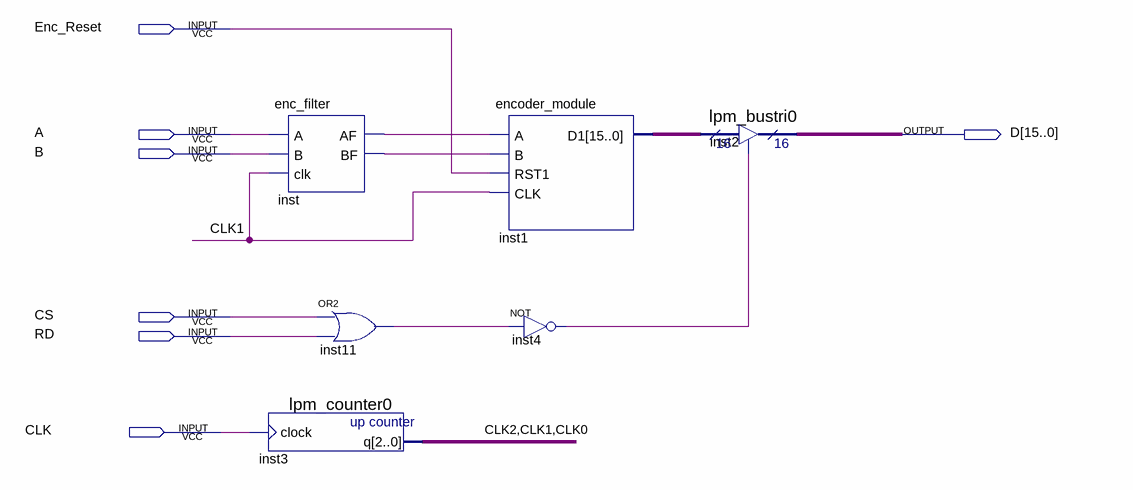
[diagram p0: schematic sheet]
// Quartus schematic encoder.bdf as structural Verilog: 6 symbols, 7 pins
module encoder (
  input  Enc_Reset,
  input  A,
  input  B,
  input  CS,
  input  RD,
  input  CLK,
  output [15:0] D
);

  wire CLK0, CLK1, CLK2, inst4_out, inst11_out, inst_af, inst_bf;
  wire [15:0] inst1_d1;

  enc_filter inst (.A(A), .B(B), .clk(CLK1), .AF(inst_af), .BF(inst_bf));
  lpm_counter0 inst3 (.clock(CLK), .q({CLK2, CLK1, CLK0}));
  or inst11 (inst11_out, CS, RD);
  encoder_module inst1 (.A(inst_af), .B(inst_bf), .RST1(Enc_Reset), .CLK(CLK1), .D1(inst1_d1));
  not inst4 (inst4_out, inst11_out);
  lpm_bustri0 inst2 (.enabledt(inst4_out), .data(inst1_d1), .tridata(D));
endmodule
